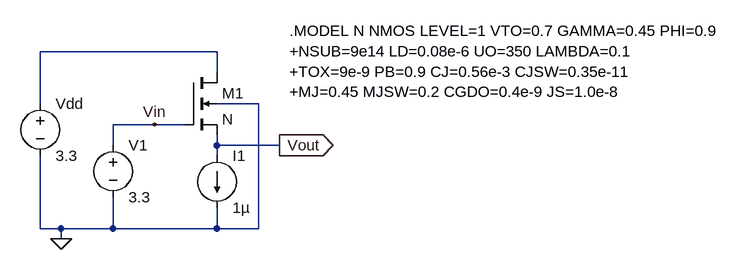
[diagram p0: schematic SourceFollower-LargeSignal.asc]
SourceFollower-LargeSignal.asc, the LTspice schematic file:
Version 4
SHEET 1 880 680
WIRE 16 -128 -256 -128
WIRE 16 -96 16 -128
WIRE -256 -48 -256 -128
WIRE 80 -48 16 -48
WIRE -80 -16 -144 -16
WIRE -32 -16 -80 -16
WIRE -144 16 -144 -16
WIRE 16 16 16 0
WIRE 112 16 16 16
WIRE 16 32 16 16
WIRE -256 144 -256 32
WIRE -224 144 -256 144
WIRE -144 144 -144 96
WIRE -144 144 -224 144
WIRE 16 144 16 112
WIRE 16 144 -144 144
WIRE 80 144 80 -48
WIRE 80 144 16 144
WIRE -224 160 -224 144
FLAG -224 160 0
FLAG 112 16 Vout
IOPIN 112 16 Out
FLAG -80 -16 Vin
SYMBOL nmos4 -32 -96 R0
SYMATTR InstName M1
SYMATTR Value N
SYMATTR Value2 l=4u w=1u
SYMBOL voltage -256 -64 R0
WINDOW 123 0 0 Left 0
WINDOW 39 0 0 Left 0
SYMATTR InstName Vdd
SYMATTR Value 3.3
SYMBOL voltage -144 0 R0
WINDOW 123 0 0 Left 0
WINDOW 39 0 0 Left 0
SYMATTR InstName V1
SYMATTR Value 3.3
SYMBOL current 16 32 R0
WINDOW 123 0 0 Left 0
WINDOW 39 0 0 Left 0
SYMATTR InstName I1
SYMATTR Value 1µ
TEXT 128 -160 Left 2 !.MODEL N NMOS LEVEL=1 VTO=0.7 GAMMA=0.45 PHI=0.9\n+NSUB=9e14 LD=0.08e-6 UO=350 LAMBDA=0.1\n+TOX=9e-9 PB=0.9 CJ=0.56e-3 CJSW=0.35e-11\n+MJ=0.45 MJSW=0.2 CGDO=0.4e-9 JS=1.0e-8

The netlist it stands for:
* SourceFollower-LargeSignal.asc
M1 N001 Vin Vout 0 N l=4u w=1u
Vdd N001 0 3.3
V1 Vin 0 3.3
I1 Vout 0 1µ
.model NMOS NMOS
.model PMOS PMOS
.lib standard.mos
.MODEL N NMOS LEVEL=1 VTO=0.7 GAMMA=0.45 PHI=0.9
+NSUB=9e14 LD=0.08e-6 UO=350 LAMBDA=0.1
+TOX=9e-9 PB=0.9 CJ=0.56e-3 CJSW=0.35e-11
+MJ=0.45 MJSW=0.2 CGDO=0.4e-9 JS=1.0e-8
.backanno
.end